# Altium project RP2040 _4 Layer_TEX(21052025).PrjPcb (part 2 of 2)

## Sheet GSM_SOM.SchDoc
size A3; SheetNumber: 6; SheetTotal: 7
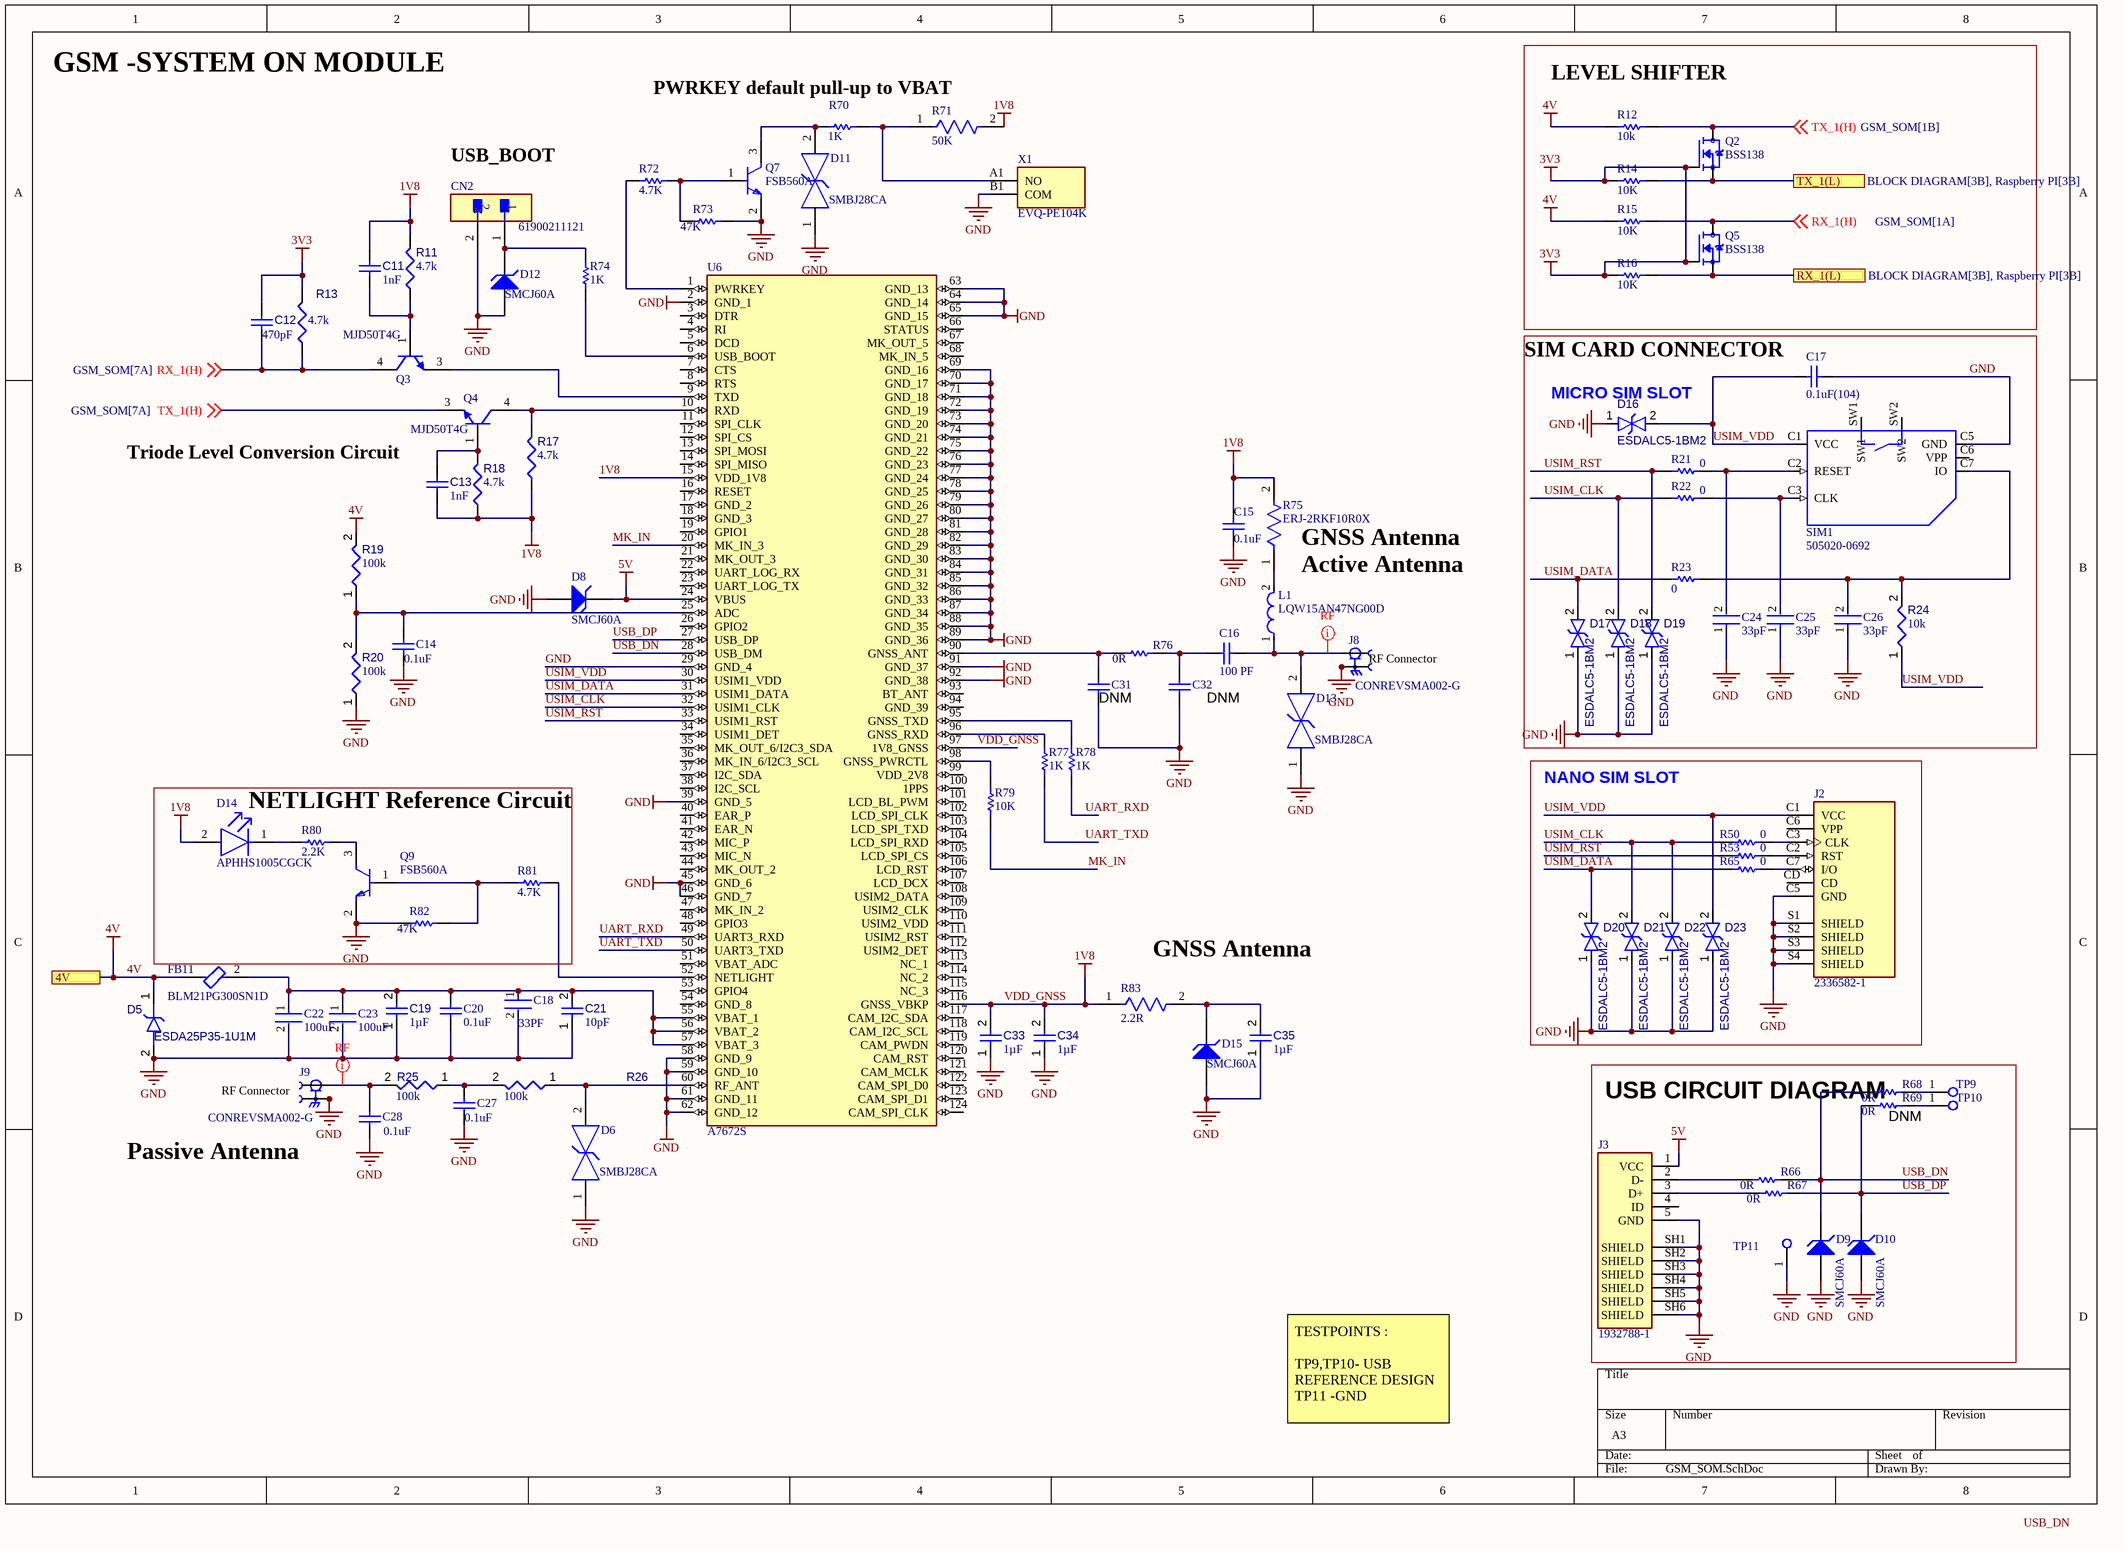
[diagram p6: GSM_SOM.SchDoc]

### Parts
C11  value 1nF  [CAPC0402(1005)33_L]  (hidden comment: Capacitor 1nF +/-20% 50V 0402)
C12  value 470pF  [CAPC0402(1005)60_L]  (hidden comment: Capacitor 470pF +/-20% 50V 0402)
C13  value 1nF  [CAPC0402(1005)33_L]  (hidden comment: Capacitor 1nF +/-20% 50V 0402)
C14  0.1uF  [CAPC1005X55X30LL05T10]
C15  0.1uF  [CAPC1005X55X30LL05T10]
C16  100 PF  [CAPC1005X55X25ML05T10]
C17  0.1uF(104)  [CAPC1005X55X30LL05T10]
C18  33PF  [FP-0402-L_1_0_1-W_0_5_0_1-IPC_A]
C19  value 1µF  [CAPC0402(1005)60_L]  (hidden comment: Capacitor 1µF +/-20% 10V 0402)
C20  0.1uF  [CAPC1005X55X30LL05T10]
C21  value 10pF  [CAPC1005X55X30LL05T10]  (hidden comment: Capacitor 10 pF +/- 0.25 pF 50 V 0402)
C22  100uF  [FP-GRM32-0_3-MFG]
C23  100uF  [FP-GRM32-0_3-MFG]
C24  33pF  [FP-0402-L_1_0_1-W_0_5_0_1-IPC_A]
C25  33pF  [FP-0402-L_1_0_1-W_0_5_0_1-IPC_A]
C26  33pF  [FP-0402-L_1_0_1-W_0_5_0_1-IPC_A]
C27  0.1uF  [CAPC1005X55X30LL05T10]
C28  0.1uF  [CAPC1005X55X30LL05T10]
C31  0.1uF  [CAPC1005X55X30LL05T10]  (value not drawn)
C32  0.1uF  [CAPC1005X55X30LL05T10]  (value not drawn)
C33  value 1µF  [CAPC0402(1005)60_L]  (hidden comment: Capacitor 1µF +/-20% 10V 0402)
C34  value 1µF  [CAPC0402(1005)60_L]  (hidden comment: Capacitor 1µF +/-20% 10V 0402)
C35  value 1µF  [CAPC0402(1005)60_L]  (hidden comment: Capacitor 1µF +/-20% 10V 0402)
CN2  61900211121  [FP-61900211121-MFG]
D5  ESDA25P35-1U1M  [STM-QFN1610]
D6  SMBJ28CA  [FP-SMBJ-CA-MFG]
D8  SMCJ60A  [LFUS-DO-214AB-2_V]
D9  SMCJ60A  [LFUS-DO-214AB-2_V]
D10  SMCJ60A  [LFUS-DO-214AB-2_V]
D11  SMBJ28CA  [FP-SMBJ-CA-MFG]
D12  SMCJ60A  [LFUS-DO-214AB-2_V]
D13  SMBJ28CA  [FP-SMBJ-CA-MFG]
D14  APHHS1005CGCK  [FP-APHHS1005CGCK-MFG]
D15  SMCJ60A  [LFUS-DO-214AB-2_V]
D16  ESDALC5-1BM2  [STM-SOD-882_V]
D17  ESDALC5-1BM2  [STM-SOD-882_V]
D18  ESDALC5-1BM2  [STM-SOD-882_V]
D19  ESDALC5-1BM2  [STM-SOD-882_V]
D20  ESDALC5-1BM2  [STM-SOD-882_V]
D21  ESDALC5-1BM2  [STM-SOD-882_V]
D22  ESDALC5-1BM2  [STM-SOD-882_V]
D23  ESDALC5-1BM2  [STM-SOD-882_V]
FB1  BLM21PG300SN1D  [FP-BLM21-0_2-t0_85-e0_5-d-MFG]
J2  2336582-1  [TE_2336582-1]
J3  1932788-1  [TE_1932788-1]
J8  CONREVSMA002-G  [LINX_CONREVSMA002-G]
J9  CONREVSMA002-G  [LINX_CONREVSMA002-G]
L1  LQW15AN47NG00D  [FP-LQW15AN_00-W0_5-0_1-MFG]
Q2  BSS138  [SOT95P240X111-3N]
Q3  MJD50T4G  [ONSC-DPAK-3-369C-01_V]
Q4  MJD50T4G  [ONSC-DPAK-3-369C-01_V]
Q5  BSS138  [SOT95P240X111-3N]
Q7  FSB560A  [FP-527AG-MFG]
Q9  FSB560A  [FP-527AG-MFG]
R11  value 4.7k  [RESC1005X40X25ML05T05]  (hidden comment: Resistor 4k7 +/-1% 0402 100 mW)
R12  10k  [RESC1005X40X25LL05T10]
R13  value 4.7k  [RESC1005X40X25ML05T05]  (hidden comment: Resistor 4k7 +/-1% 0402 100 mW)
R14  10K  [RESC1005X40X25LL05T10]
R15  10K  [RESC1005X40X25LL05T10]
R16  10K  [RESC1005X40X25LL05T10]
R17  value 4.7k  [RESC1005X40X25ML05T05]  (hidden comment: Resistor 4k7 +/-1% 0402 100 mW)
R18  value 4.7k  [RESC1005X40X25ML05T05]  (hidden comment: Resistor 4k7 +/-1% 0402 100 mW)
R19  value 100k  [RESC0402(1005)_L]  (hidden comment: Resistor 100K +/-1 % 0402 63 mW)
R20  value 100k  [RESC0402(1005)_L]  (hidden comment: Resistor 100K +/-1 % 0402 63 mW)
R21  value 0  [RESC1005X40X25ML05T10]  (hidden comment: Resistor 0R 0402 63 mW)
R22  value 0  [RESC1005X40X25ML05T10]  (hidden comment: Resistor 0R 0402 63 mW)
R23  value 0  [RESC1005X40X25ML05T10]  (hidden comment: Resistor 0R 0402 63 mW)
R24  value 10k  [RESC1005X40X25ML05T05]  (hidden comment: Resistor 10k +/-1% 0402 100 mW)
R25  value 100k  [RESC0402(1005)_L]  (hidden comment: Resistor 100K +/-1 % 0402 63 mW)
R26  value 100k  [RESC0402(1005)_L]  (hidden comment: Resistor 100K +/-1 % 0402 63 mW)
R50  value 0  [RESC1005X40X25ML05T10]  (hidden comment: Resistor 0R 0402 63 mW)
R53  value 0  [RESC1005X40X25ML05T10]  (hidden comment: Resistor 0R 0402 63 mW)
R65  value 0  [RESC1005X40X25ML05T10]  (hidden comment: Resistor 0R 0402 63 mW)
R66  0R  [RESC1005X40X25NL05T10]
R67  0R  [RESC1005X40X25NL05T10]
R68  0R  [RESC1005X40X25NL05T10]
R69  0R  [RESC1005X40X25NL05T10]
R70  1K  [RESC1005X40X25NL05T05]
R71  50K  [FP-CRCW0402-e3-IPC_A]
R72  4.7K  [RESC1005X40X25LL05T05]
R73  47K  [RESC1005X40X25ML05T10]
R74  1K  [RESC1005X40X25NL05T05]
R75  ERJ-2RKF10R0X  [FP-ERJ2RK-MFG]
R76  0R  [RESC1005X40X25NL05T10]
R77  1K  [RESC1005X40X25NL05T05]
R78  1K  [RESC1005X40X25NL05T05]
R79  10K  [RESC1005X40X25LL05T05]
R80  2.2K  [RESC1005X40X25NL05T10]
R81  4.7K  [RESC1005X40X25LL05T05]
R82  47K  [RESC1005X40X25ML05T10]
R83  2.2R  [FP-CRCW0402-e3-IPC_C]
SIM1  505020-0692  [505020-0692]
TP9  Test Point  [TEST_POINT_SMD_30D]  (value not drawn)
TP10  Test Point  [TEST_POINT_SMD_30D]  (value not drawn)
TP11  Test Point  [TEST_POINT_SMD_30D]  (value not drawn)
U6  A7672S  [A7672S]
X1  EVQ-PE104K  [EVQPE104K]

### Blocks framed on the sheet
LEVEL SHIFTER: Q2 Q5 R12 R14-R16
SIM CARD CONNECTOR: C17 C24-C26 D16-D19 R21-R24 SIM1
NANO SIM SLOT: D20-D23 J2 R50 R53 R65
NETLIGHT Reference Circuit: D14 Q9 R80-R82
USB CIRCUIT DIAGRAM: D9 D10 J3 R66-R69 TP9-TP11

### Ports
4V (see BLOCK DIAGRAM[3B], Power circuit[4D]), RX_1(L) (see BLOCK DIAGRAM[3B], Raspberry PI[3B]), TX_1(L) (see BLOCK DIAGRAM[3B], Raspberry PI[3B])

### Nets
1V8: C11.1 C13.2 C15.2 C33.2 C34.2 D14.2(A) R11.2 R17.1 R18.1 R71.2 R75.2 R83.1 U6.15(VDD_1V8) U6.97(1V8_GNSS) U6.116(GNSS_VBKP)  [also labelled VDD_GNSS]
3V3: C12.2 Q2.1(G) Q5.1(G) R13.2 R14.1 R16.1
4V: D5.1(A) FB1.1 R12.1 R15.1 R19.2 ; port 4V
5V: D8.2(K) J3.1(VCC) U6.24(VBUS)
GND: C14.2 C15.1 C17.2 C18.2 C19.1 C20.2 C21.1 C22.2 C23.2 C24.1 C25.1 C26.1 C27.2 C28.2 C31.1 C32.1 C33.1 C34.1 C35.1 CN2.2 D5.2(A) D6.1 D8.1(A) D9.1(A) D10.1(A) D11.1 D12.1(A) D13.1 D15.1(A) D16.1(A) D17.1(A) D18.1(A) D19.1(A) D20.1(A) D21.1(A) D22.1(A) D23.1(A) J2.C5(GND) J2.S1(SHIELD) J2.S2(SHIELD) J2.S3(SHIELD) J2.S4(SHIELD) J3.5(GND) J3.SH1(SHIELD) J3.SH2(SHIELD) J3.SH3(SHIELD) J3.SH4(SHIELD) J3.SH5(SHIELD) J3.SH6(SHIELD) J8.S1 J8.S2 J8.S3 J8.S4 J9.S1 J9.S2 J9.S3 J9.S4 Q7.2(E) Q9.2(E) R20.1 R73.2 R82.1 SIM1.C5(GND) TP11.1 U6.2(GND_1) U6.29(GND_4) U6.39(GND_5) U6.45(GND_6) U6.46(GND_7) U6.58(GND_9) U6.59(GND_10) U6.61(GND_11) U6.62(GND_12) U6.63(GND_13) U6.64(GND_14) U6.65(GND_15) U6.69(GND_16) U6.70(GND_17) U6.71(GND_18) U6.72(GND_19) U6.73(GND_20) U6.74(GND_21) U6.75(GND_22) U6.76(GND_23) U6.77(GND_24) U6.78(GND_25) U6.79(GND_26) U6.80(GND_27) U6.81(GND_28) U6.82(GND_29) U6.83(GND_30) U6.84(GND_31) U6.85(GND_32) U6.86(GND_33) U6.87(GND_34) U6.88(GND_35) U6.89(GND_36) U6.91(GND_37) U6.92(GND_38) X1.B1(COM)
MK_IN: R79.1 U6.20(MK_IN_3)  [project net MK_IN_6]
RX_1(H): C12.1 Q3.4(C) Q5.3(D) R13.1 R15.2 ; off-sheet RX_1(H)
RX_1(L): Q5.2(S) R16.2 ; port RX_1(L)
TX_1(H): Q2.3(D) Q4.3(E) R12.2 ; off-sheet TX_1(H)
TX_1(L): Q2.2(S) R14.2 ; port TX_1(L)
UART_RXD: R78.1 U6.49(UART3_RXD)  [project net UART_RXD_6]
UART_TXD: R77.1 U6.50(UART3_TXD)  [project net UART_TXD_6]
USB_DN: D9.2(K) R66.2 R68.1 U6.28(USB_DM)  [project net USB_DN_6]
USB_DP: D10.2(K) R67.2 R69.1 U6.27(USB_DP)  [project net USB_DP_6]
USIM_CLK: D18.2(A) D21.2(A) D22.2(A) R22.1 R50.1 U6.32(USIM1_CLK)  [project net USIM_CLK_6]
USIM_DATA: D17.2(A) D20.2(A) R23.1 R65.1 U6.31(USIM1_DATA)  [project net USIM_DATA_6]
USIM_RST: D19.2(A) R21.1 R53.1 U6.33(USIM1_RST)  [project net USIM_RST_6]
USIM_VDD: C17.1 D16.2(A) D23.2(A) J2.C1(VCC) R24.1 SIM1.C1(VCC) U6.30(USIM1_VDD)  [project net USIM_VDD_6]
NetC11_2: C11.2 Q3.1(B) R11.1
NetC13_1: C13.1 Q4.1(B) R18.2
NetC14_1: C14.1 R19.1 R20.2 U6.25(ADC)
NetC16_1: C16.1 C32.2 R76.2
NetC16_2: C16.2 D13.2 J8.1 L1.1
NetC18_1: C18.1 C19.2 C20.1 C21.2 C22.1 C23.1 FB1.2 U6.55(VBAT_1) U6.56(VBAT_2) U6.57(VBAT_3)
NetC24_2: C24.2 R21.2 SIM1.C2(RESET)
NetC25_2: C25.2 R22.2 SIM1.C3(CLK)
NetC26_2: C26.2 R23.2 R24.2 SIM1.C7(IO)
NetC27_1: C27.1 R25.1 R26.2
NetC28_1: C28.1 J9.1 R25.2
NetC31_2: C31.2 R76.1 U6.90(GNSS_ANT)
NetC35_2: C35.2 D15.2(K) R83.2
NetCN2_1: CN2.1 D12.2(K) R74.2
NetD6_2: D6.2 R26.1 U6.60(RF_ANT)
NetD11_2: D11.2 Q7.3(C) R70.1
NetD14_1: D14.1(C) R80.1
NetJ2_C2: J2.C2(RST) R53.2
NetJ2_C3: J2.C3(CLK) R50.2
NetJ2_C7: J2.C7(I/O) R65.2
NetJ3_2: J3.2(D-) R66.1
NetJ3_3: J3.3(D+) R67.1
NetL1_2: L1.2 R75.1
NetQ3_3: Q3.3(E) U6.9(TXD)
NetQ4_4: Q4.4(C) R17.2 U6.10(RXD)
NetQ7_1: Q7.1(B) R72.2 R73.1
NetQ9_1: Q9.1(B) R81.2 R82.2
NetQ9_3: Q9.3(C) R80.2
NetR68_2: R68.2 TP9.1
NetR69_2: R69.2 TP10.1
NetR70_2: R70.2 R71.1 X1.A1(NO)
NetR72_1: R72.1 U6.1(PWRKEY)
NetR74_1: R74.1 U6.6(USB_BOOT)
NetR77_2: R77.2 U6.96(GNSS_RXD)
NetR78_2: R78.2 U6.95(GNSS_TXD)
NetR79_2: R79.2 U6.98(GNSS_PWRCTL)
NetR81_1: R81.1 U6.52(NETLIGHT)

Not connected (* = marked no-connect by the designer): J2 C6(VPP) CD; J3 4(ID); SIM1 C6(VPP) SW1 SW2; U6 3(DTR) 4(RI) 5(DCD) 7(CTS) 8(RTS) 11(SPI_CLK) 12(SPI_CS) 13(SPI_MOSI) 14(SPI_MISO) 16(RESET) 17(GND_2) 18(GND_3) 19(GPIO1) 21(MK_OUT_3) 22(UART_LOG_RX) 23(UART_LOG_TX) 26(GPIO2) 34(USIM1_DET) 35(MK_OUT_6/I2C3_SDA) 36(MK_IN_6/I2C3_SCL) 37(I2C_SDA) 38(I2C_SCL) 40(EAR_P) 41(EAR_N) 42(MIC_P) 43(MIC_N) 44(MK_OUT_2) 47(MK_IN_2) 48(GPIO3) 51(VBAT_ADC) 53(GPIO4) 54(GND_8) 66(STATUS) 67(MK_OUT_5) 68(MK_IN_5) 93(BT_ANT) 94(GND_39) 99(VDD_2V8) 100(1PPS) 101(LCD_BL_PWM) 102(LCD_SPI_CLK) 103(LCD_SPI_TXD) 104(LCD_SPI_RXD) 105(LCD_SPI_CS) 106(LCD_RST) 107(LCD_DCX) 108(USIM2_DATA) 109(USIM2_CLK) 110(USIM2_VDD) 111(USIM2_RST) 112(USIM2_DET) 113(NC_1) 114(NC_2) 115(NC_3) 117(CAM_I2C_SDA) 118(CAM_I2C_SCL) 119(CAM_PWDN) 120(CAM_RST) 121(CAM_MCLK) 122(CAM_SPI_D0) 123(CAM_SPI_D1) 124(CAM_SPI_CLK)

### Layout directives
mark named RF: NetC16_2, NetC28_1

### Notes on the sheet
- GSM -SYSTEM ON MODULE
- PWRKEY default pull-up to VBAT
- USB_BOOT
- (near D16) MICRO SIM SLOT
- (near C13) Triode Level Conversion Circuit
- Active Antenna
- (near R75) GNSS Antenna
- (near C31) DNM
- DNM
- (near J8) RF Connector
- (near R83) GNSS Antenna
- (near J9) RF Connector
- (near R69) DNM
- Passive Antenna
- TESTPOINTS :
  TP9,TP10- USB REFERENCE DESIGN
  TP11 -GND
- Labels drawn without touching a wire or pin: USB_DN

### Library data of the parts
C11 C13 = CMP-001-00066-3: Chip Capacitor, 1nF +/-20%, 50V, 0402, Thickness 0.33 mm; Tolerance: 10%; Case/Package: 0402; Pins: 2; Min Operating Temperature: -55°C; Max Operating Temperature: 85°C; Voltage Rating: 50V; Mounting Technology: SMT
C12 = CMP-001-00068-4: Chip Capacitor, 470pF +/-20%, 50V, 0402, Thickness 0.6 mm; Tolerance: 20%; Mounting Technology: SMT; Max Operating Temperature: 85°C; Min Operating Temperature: -55°C; Pins: 2; Voltage Rating: 50V; Case/Package: 0402
C14 C15 C17 C20 C27 C28 C31 C32 = CMP-0001-00074-2: Manufacturer: Kemet; Part Number: C0402C104K4RACTU
C16 = CMP-2008-03915-1: Manufacturer: Murata; Part Number: GRM1555C1H101JA01D
C18 C24-C26 = CMP-2008-02637-2: General Purpose Ceramic Capacitor, 0402, 33pF, 5%, C0G, 30ppm/°C, 50V; Insulation Resistance: 100GR; REACH SVHC: No SVHC; Radiation Hardening: No; Voltage Rating (DC): 50V; Tolerance: 5%; Voltage Rating: 50V; Mount: Surface Mount; Packaging: Tape and Reel; Construction: Flat; Voltage: 50V; Case/Package: 0402; Temperature Coefficient: 30ppm/°C; Lead Free: Lead Free; Case Code (Metric): 1005; Number of Pins: 2; Min Operating Temperature: -55°C; Capacitance: 33pF; Width: 0.5mm; Dielectric: C0G; Height: 0.5mm; Thickness: 0.022inch; Contact Plating: Tin; Length: 1mm; Package Quantity: 1; Depth: 0.5mm; Termination: SMD/SMT; Max Operating Temperature: 125°C; RoHS Compliant: Yes; Case Code (Imperial): 0402; Series: -
C19 C33-C35 = CMP-001-00063-3: Chip Capacitor, 1µF +/-20%, 10V, 0402, Thickness 0.6 mm; Tolerance: 10%; Mounting Technology: SMT; Max Operating Temperature: 85°C; Voltage Rating: 10V; Pins: 2; Case/Package: 0402; Min Operating Temperature: -55°C
C21 = CMP-001-00011-6: Chip Capacitor, 10 pF, +/- 0.25 pF, 50 V, 0402 (1005 Metric); Voltage Rating: 50V; Tolerance: 0.25%; Capacitor Type: Ceramic; Mounting Technology: SM; Pins: 2; Case/Package: 0402; Min Operating Temperature: -55°C; RoHS Compliant: True; Max Operating Temperature: 125°C
C22 C23 = CMP-2000-05259-2: CAP CER 100UF 6.3V X5R 1210; 3DS Part Number: 220-00002; Manufacturer Part Number: GRM32ER60J107ME20L; Manufacturer: Murata; Temperature Coefficient: 15%; Material: Ceramic; Tolerance: 20%; Octopart: https://octopart.com/grm32er60j107me20l-murata-197007; ComponentLink2URL: https://search.murata.co.jp/Ceramy/image/img/A01X/G101/ENG/GRM32ER60J107ME20-01.pdf; Temperature Range High: +85°C; RoHS: TRUE; Device Class L3: Ceramic Capacitors; Device Class L2: Capacitors; Voltage: 6.3V; Package: GRM32-0.3; Voltage Rating: 6.3V; Category: Cap; Device Class L1: Passive Components; Temperature Characteristic: X5R; Automotive: No; Digikey Description: CAP CER 100UF 6.3V X5R 1210; Temperature: -55°C to +85°C; Height: 2.7mm; Ipc Land Pattern Name: CAPC320250X250; Capacitance: 100uF; Temperature Range Low: -55°C; Lead Free: Yes; Value: 100uF; ComponentLink2Description: Datasheet
CN2 = CMP-1502-00584-2: CONN HEADER VERT 2POS 2.54MM; Number of Contacts: 2; Gender: Male; Current Rating: 3A; Voltage Rating: 250V; Insulation Resistance: 1GR; Contact Material: Copper Alloy; Package Quantity: 1000; Color: Beige; Mount: Through Hole; Termination: Through Hole; Fastening Type: Friction; Contact Mating Length: 0.295inch; Pitch: 2.54mm; Max Operating Temperature: 105°C; Height: 14.2mm; RoHS Compliant: Yes; Packaging: Bulk; Contact Type: Male Pin; Width: 5.12mm; Housing Material: Nylon; Min Operating Temperature: -40°C; Insulation Material: Nylon; Contact Finish - Mating: TIN; Insulation Color: Beige; Contact Plating: Tin; Flammability Rating: UL94 V-0; Length: 5.8mm; Contact Gender: Male; Connector Type: Header; Contact Shape: Square; Series: WR-WTB; Number of Positions: 2; Number of Rows: 1
D5 = CMP-004-00023-3: TVS DIODE 22V 41V 1610; Peak Inverse Voltage: 23.3V; Max Surge Current: 35A; Mounting Technology: SMT; Case/Package: QFN1610 (0603); RoHS Compliant: Yes; Pins: 2
D6 D11 D13 = CMP-08607-000057-1: TVS DIODE 28V 45.4V DO214AA; Manufacturer: Littelfuse Inc; Direction: Bidirectional; Peak Pulse Power: 600W; Max Junction Temp: +150°C; Peak Pulse Current: 13.3A; Breakdown Voltage: 31.1V; Number Of Channels: 1; Digikey Description: TVS DIODE 28V 45.4V DO214AA; Temperature Range Low: -65°C; Device Class L1: Circuit Protection; Automotive: No; Device Class L3: unset; Octopart: https://octopart.com/smbj28ca-littelfuse-350757; Temperature Range High: +150°C; Reverse Standoff Voltage: 28V; Mouser Description: In a Pack of 10, Littelfuse SMBJ28CA, Bi-Directional TVS Diode, 600W, 2-Pin DO-214AA; Category: Diode; Device Class L2: TVS Diodes; ComponentLink2URL: https://www.littelfuse.com/~/media/electronics/datasheets/tvs_diodes/littelfuse_tvs_diode_smbj_datasheet.pdf.pdf; Clamping Voltage: 45.4V; Manufacturer Part Number: SMBJ28CA; RoHS: TRUE; Height: 2.61mm; Package: SMBJ-CA; ComponentLink2Description: Datasheet; Lead Free: Yes; Temperature: -65°C to +150°C
D8-D10 D12 D15 = CMP-2000-07111-1: Transient Voltage Suppression Diode, 60 V, -65 to 150 degC, 2-Pin DO-214AB (SMCJ), RoHS, Tape and Reel; Manufacturer: Littelfuse; Type: Zener; Featured Product: LittelfuseandDigi-KeyofferkitsforpopularTVSSMDdiodes; Power - Peak Pulse: 1500W(1.5kW); Current - Peak Pulse (10/1000µs): 145.7A; Power Line Protection: No; Voltage - Clamping (Max) @ Ipp: 10.3V; Unidirectional Channels: 1; Voltage - Reverse Standoff (Typ): 6V; Catalog Drawings: SMCJDO-214ABSeries; Voltage - Breakdown (Min): 6.67V; Bidirectional Channels: -; Series: SMCJ; Mounting Technology: SurfaceMount; Supplier Device Package: DO-214AB(SMCJ); Packaging: Tape&Reel(TR); Family: TVS-Diodes; Applications: GeneralPurpose; Package Description: 2-Pin Surface Mount Device, Body 6.855 x 5.905 mm; Datasheet Version: 11/2015; Operating Temperature: -55°C~150°C(TJ); Package Reference: DO-214AB; Capacitance @ Frequency: -; Datasheet URL: http://www.littelfuse.com/products/tvs-diodes/surface-mount/~/media/electronics/datasheets/tvs_diodes/littelfuse_tvs_diode_smcj_datasheet.pdf.pdf; Category: CircuitProtection; Package / Case: DO-214AB,SMC; Mounting Type: SurfaceMount; Manufacturer URL: http://www.littelfuse.com/; Standard Package: 3,000
D14 = CMP-44529-000044-1: LED GREEN CLEAR CHIP SMD; Viewing Angle: 120°; Dominant Wavelength: 570nm; Test Current: 20mA; Luminous Intensity: 50mcd; Forward Voltage: 2.1V; Number of LEDs: 1; Lens Color: Clear; Packaging: Tape and Reel; Max Operating Temperature: 85°C; Illumination Color: Green; Length: 1mm; Mount: Surface Mount; Lens Style: Clear; Color: Green; Number of Pins: 2; Wavelength: 570nm; Case/Package: 0402; Width: 0.5mm; Package Quantity: 2000; Case Code (Metric): 1005; Height: 0.6mm; Lead Free: Lead Free; Case Code (Imperial): 0402; Forward Current: 20mA; Min Operating Temperature: -40°C
D16-D23 = CMP-004-00030-3: Single Line Low Capacitance Transil™, 5 V, -55 to 150 degC, 2-Pin SOD-882, RoHS, Tape and Reel; Mounting Technology: SMT; Pins: 2
FB1 = CMP-0686-00620-3: Chip Ferrite Bead, 0805, 30Ω @ 100MHz, 0.014Ω, , 4A; Tolerance: 25%; Number of Circuits: 1; Impedance: 30R; Max DC Current: 3A; Shielding: Unshielded; Material: Steel; Resistance: 15mR; DC Resistance-Max: 14mR; Series: BLM21P; Military Standard: Not; Max Current Rating: 4A; Termination: SMD/SMT; Length: 2mm; Width: 1.25mm; Test Frequency: 100MHz; Packaging: Tape and Reel; Case/Package: 0805; Current Rating: 4A; Depth: 1.25mm; Package Quantity: 1; REACH SVHC: No SVHC; Core Material: Ferrite; Max Operating Temperature: 125°C; DC Current: 3A; Height: 0.85mm; Frequency: 100MHz; Number of Lines: 1; Case Code (Metric): 2012; Min Operating Temperature: -55°C; Radiation Hardening: No; Case Code (Imperial): 0805; Number of Pins: 2; RoHS Compliant: Yes; DC Resistance (DCR): 14mR; Lead Free: Lead Free
J2 = 2336582-1: PUSH-PUSH NANO SIM CONNECTOR; Package: None; Price: None; Value: *; MP: 2336582-1; Availability: Unavailable
J8 J9 = CONREVSMA002-G: RP-SMA Female Right-Angle Through-Hole Mount Connector, Gold; MF: Linx Technologies; SnapEDA_Link: https://www.snapeda.com/parts/CONREVSMA002-G/Linx+Technologies+Inc./view-part/?ref=snap; Package: None; Value: *; MP: CONREVSMA002-G; Check_prices: https://www.snapeda.com/parts/CONREVSMA002-G/Linx+Technologies+Inc./view-part/?ref=eda
L1 = CMP-06042-006618-1: Wire Wound RF Inductor 47nH ±2% 210mA 1.08Ω 0402 (1005); Core Material: Air; Q Factor: 25; Current: 600mA; Test Frequency: 100MHz; DC Resistance (DCR): 1.08R; Shielding: Unshielded; Self Resonant Frequency: 2.9GHz; Packaging: Tape and Reel; Current Rating: 210mA; Mount: Surface Mount; REACH SVHC: No SVHC; Min Operating Temperature: -55°C; Package Quantity: 10000; Inductance Tolerance: 2%; Inductance: 47nH; Lead Free: Lead Free; Height: 0.5mm; Depth: 0.6mm; Weight: 2.8E-05oz; Max Operating Temperature: 125°C; Radiation Hardening: No; DC Current: 210mA; Number of Pins: 2; Width: 0.02inch; Military Standard: Not; Termination: SMD/SMT; Tolerance: 2%; Max DC Current: 210mA; Case Code (Imperial): 0402; Case/Package: 0402; Length: 1mm; Case Code (Metric): 1005
Q2 Q5 = BSS138: N-Channel 50V 220mA (Ta) 360mW (Ta) Surface Mount SOT-23-3; MF: ON Semiconductor; MP: BSS138; Price: None; SnapEDA_Link: https://www.snapeda.com/parts/BSS138/ON%20Semiconductor/view-part/4794929/?ref=snap; Availability: Good; Purchase-URL: https://pricing.snapeda.com/search/part/BSS138/?ref=eda; Value: *; Check_prices: https://www.snapeda.com/parts/BSS138/ON%20Semiconductor/view-part/4794929/?ref=eda; Package: SOT-23 ON Semiconductor
Q3 Q4 = CMP-1048-00190-1: High Voltage Power Transistor, 3-Pin DPAK, Pb-Free, Tape and Reel; Manufacturer: On Semiconductor; Polarity: NPN; fT Min (MHz): 10; IC Continuous (A): 1; ComponentLink1Description: Manufacturer URL; PartNumber: MJD50T4G; ComponentLink3URL: http://www.onsemi.cn/pub_link/Collateral/369C.PDF; Mounting Technology: Surface Mount; DatasheetVersion: Rev. 14; PackageDescription: 3-Pin Flange Mount, Body 6.54 x 6.095 mm, Pitch 2.29 mm; ComponentLink1URL: http://www.onsemi.com/; RoHS: TRUE; ComponentLink2Description: Datasheet; PackageVersion: Rev. E, 02/2014; ComponentLink3Description: Package Specification; PackageReference: DPAK-3-369C-01; ComponentLink2URL: http://www.onsemi.cn/pub_link/Collateral/MJD47-D.PDF; Packing: Tape and Reel
Q7 Q9 = CMP-00278-84328379-1: FSB560A Bipolar Transistors - BJT NPN Transistor Low Saturation; Manufacturer Lifecycle Status: ACTIVE; Transition Frequency: 75MHz; Power Dissipation: 500mW; Current Rating: 2A; Collector Emitter Breakdown Voltage: 60V; hFE Min: 250; Number of Elements: 1; Max Breakdown Voltage: 25V; Emitter Base Voltage (VEBO): 5V; Collector Base Voltage (VCBO): 80V; Element Configuration: Single; Collector Emitter Saturation Voltage: 300mV; Lead Free: Lead Free; Voltage Rating (DC): 60V; Lifecycle Status: Production; Mount: Surface Mount; Polarity: NPN; Max Frequency: 75MHz; Frequency: 75MHz; Width: 1.4mm; RoHS: Compliant; Min Operating Temperature: -55°C; Case/Package: TO-236-3; Height: 940µm; Max Collector Current: 2A; Collector Emitter Voltage (VCEO): 60V; Gain Bandwidth Product: 75MHz; Weight: 30mg; NexarPartId: 84328379; Length: 2.92mm; Max Power Dissipation: 500mW; Schedule B: 8541210080; Radiation Hardening: No; Max Operating Temperature: 150°C; Number of Pins: 3
R11 R13 R17 R18 = CMP-009-00030-5: Chip Resistor, 4.7 KOhm, +/- 1%, 0.1 W, -55 to 155 degC, 0402 (1005 Metric); Power: 100mW; Voltage Rating: 50V; Mounting Technology: SM; RoHS Compliant: True; Tolerance: 1%; Min Operating Temperature: -55°C; Max Operating Temperature: 155°C; Case/Package: 0402; Pins: 2
R12 R14-R16 = CMP-2002-07353-1: Part Number: RC0402FR-0710KL; Manufacturer: Yageo / Phycomp
R19 R20 R25 R26 = CMP-009-00168-3: Chip Resistor, 100 kOhms, +/-1 %, 63 mW, -55 to 155 degC, 0402; Tolerance: 1%; Power: 63mW; Max Operating Temperature: 155°C; Min Operating Temperature: -55°C; Pins: 2; Case/Package: 0402
R21-R23 R50 R53 R65 = CMP-009-00004-5: Chip Resistor, 0 Ohm, 0.063 W, -55 to 155 degC, 0402 (1005 Metric); Power: 63mW; Voltage Rating: 50V; Max Operating Temperature: 155°C; Pins: 2; RoHS Compliant: True; Min Operating Temperature: -55°C; Mounting Technology: SM; Case/Package: 0402
R24 = CMP-009-00015-5: Chip Resistor, 10 KOhm, +/- 1%, 0.1 W, -55 to 155 degC, 0402 (1005 Metric); Voltage Rating: 50V; Power: 100mW; Case/Package: 0402; RoHS Compliant: True; Min Operating Temperature: -55°C; Mounting Technology: SM; Tolerance: 1%; Max Operating Temperature: 155°C; Pins: 2
R66-R69 R76 = CMP-1011-00001-2: Manufacturer: Yageo / Phycomp; Part Number: RC0402JR-070RL
R70 R74 R77 R78 = CMP-1011-00510-4: Chip Resistor, 1 KOhm, +/- 1%, 100 mW, -55 to 155 degC, 0402 (1005 Metric), RoHS, Tape and Reel; PartNumber: ERJ-2RKF1001X; Manufacturer: Basic Passives; Voltage Rating: 50 V; Case\/Package: 0402; Resistance: 1 KOhm; Power Rating: 100 mW; DatasheetVersion: 04/2015; Radiation Hardening: No; Pins: 2; Height: 0.35 mm; RoHSCompliant: true; Case Code (Imperial): 0402; ComponentLink2Description: Datasheet; ComponentLink1Description: Manufacturer URL; PackageReference: 0402; Mount: Surface Mount; Package Quantity: 10000; Tolerance: 1%; ComponentLink1URL: http://www.panasonic.com/; PackageDescription: 2-Pin Surface Mount Device, Body 1 x 0.5 mm; Mounting Technology: Surface Mount; Case Code (Metric): 1005; ComponentLink2URL: http://industrial.panasonic.com/cdbs/www-data/pdf/RDA0000/AOA0000C86.pdf; REACH SVHC: Yes; Packaging: Tape and Reel; Max Operating Temperature: 155 degC; Min Operating Temperature: -55 degC; Width: 0.5 mm; Length: 1 mm
R71 = CMP-02407-005152-1: RES Thick Film, 50kΩ, 1%, 0.063W, 100ppm/°C, 0402; Power Rating: 63mW; Voltage Rating: 50V; Resistance: 50kR; Package Quantity: 10000; Case/Package: 0402; Max Operating Temperature: 155°C; Case Code (Metric): 1005; Termination: SMD/SMT; Lead Free: Lead Free; Height: 0.35mm; Width: 0.5mm; Packaging: Tape and Reel; Min Operating Temperature: -55°C; Length: 1mm; Tolerance: 1%; Case Code (Imperial): 0402; Weight: 2.3E-05oz
R72 R81 = CMP-2002-01154-4: Chip Resistor, 4.7 KOhm, +/- 1%, 0.1 W, -55 to 155 degC, 0402 (1005 Metric), RoHS, Tape and Reel; PartNumber: ERJ-2RKF4701X; Voltage Rating: 50 V; Case\/Package: 0402; Power Rating: 100 mW; Height: 0.35 mm; Mounting Technology: Surface Mount; REACH SVHC: Yes; Resistance: 4.7 KOhm; Max Operating Temperature: 155 degC; ComponentLink1Description: Manufacturer URL; ComponentLink2Description: Datasheet; Pins: 2; PackageReference: 0402; Tolerance: 1%; Case Code (Imperial): 0402; Length: 1 mm; PackageDescription: 2-Pin Surface Mount Device, Body 1 x 0.5 mm; RoHSCompliant: true; Package Quantity: 1; Radiation Hardening: No; DatasheetVersion: 04/2015; Width: 0.5 mm; Case Code (Metric): 1005; Mount: Surface Mount; ComponentLink1URL: http://www.panasonic.com/; Min Operating Temperature: -55 degC; Packaging: Cut Tape; ComponentLink2URL: http://industrial.panasonic.com/cdbs/www-data/pdf/RDA0000/AOA0000C86.pdf
R73 R82 = CMP-2002-07701-1: Part Number: RC0402FR-0747KL; Manufacturer: Yageo / Phycomp
R75 = CMP-2002-00622-4: RES SMD 10 OHM 1% 1/10W 0402; Manufacturer: Panasonic; Power Rating: 0.1W; Value: 10Ω; Automotive Grade: Grade 0; Temperature Coefficient: 100ppm/°C; Voltage Rating: 50V; Octopart: https://octopart.com/erj-2rkf10r0x-panasonic-55404982; Digikey Description: RES SMD 10 OHM 1% 1/10W 0402; Mouser Description: Thick Film Resistors - SMD 0402 10.0ohms 1% Tol AEC-Q200; Series: ERJ; Temperature Range High: +155°C; ComponentLink2Description: Datasheet; Tolerance: 1%; Manufacturer Part Number: ERJ-2RKF10R0X; Temperature Range Low: -55°C; RoHS: TRUE; Footprint Url: https://industrial.panasonic.com/cdbs/www-data/pdf/RDA0000/DMA0000COL17.pdf; Lead Free: Yes; Device Class L2: Resistors; ComponentLink2URL: https://industrial.panasonic.com/cdbs/www-data/pdf/RDA0000/AOA0000C304.pdf; Height: 0.4mm; Device Class L3: Chip SMD Resistors; Device Class L1: Passive Components; Automotive: Yes; Resistance: 10Ω; Category: Res; Temperature: -55°C to +155°C; Composition: Thick Film; Package: ERJ2RK
R79 = CMP-2000-07588-1: Chip Resistor, 10 KOhm, +/- 1%, 0.1 W, -55 to 155 degC, 0402 (1005 Metric), RoHS, Tape and Reel; Manufacturer: Panasonic; Power Rating: 100mW; Voltage Rating: 50V; Resistance: 10KOhm; Case\/Package: 0402; Temperature Coefficient: 100ppm\/degreesC; RoHSCompliant: True; Lead Free: LeadFree; Package Quantity: 1; Contact Plating: Tin; Length: 1mm; Radiation Hardening: No; REACH SVHC: NoSVHC; Max Operating Temperature: 155degC; Depth: 0.5mm; Case Code (Imperial): 0402; Military Standard: Not; Package Description: 2-Pin Surface Mount Device, Body 1 x 0.5 mm; Termination: SMD/SMT; Case Code (Metric): 1005; Height: 0.35mm; Packaging: TapeandReel; Voltage Rating (DC): 50V; Package Reference: 402; Number of Pins: 2; Tolerance: 1%; Mounting Technology: SurfaceMount; Width: 0.02inch; Mount: SurfaceMount; Datasheet URL: https://industrial.panasonic.com/cdbs/www-data/pdf/RDA0000/AOA0000C304.pdf; Composition: ThickFilm; Datasheet Version: 02/2017; Manufacturer URL: http://www.panasonic.com/; Max Power Dissipation: 100mW; Number of Terminations: 2; Min Operating Temperature: -55degC
R80 = CMP-2002-07567-1: Manufacturer: Yageo / Phycomp; Part Number: RC0402FR-072K2L
R83 = CMP-1011-00207-2: RES Thick Film, 2.2Ω, 1%, 0.063W, 100ppm/°C, 0402; Voltage Rating: 50V; Max Power Dissipation: 63mW; Weight: 2.3E-05oz; Max Operating Temperature: 155°C; Number of Terminations: 2; Depth: 0.5mm; Voltage Rating (DC): 50V; Case/Package: 0402; Height: 0.35mm; Resistance: 2.2R; Lead Free: Lead Free; Width: 0.5mm; Package Quantity: 10; Termination: SMD/SMT; Number of Pins: 2; Case Code (Metric): 1005; Composition: Thick Film; Packaging: Tape and Reel; Temperature Coefficient: 100ppm/°C; Case Code (Imperial): 0402; Radiation Hardening: No; Features: Automotive AEC-Q200; Military Standard: Not; Contact Plating: Tin; Tolerance: 1%; Power Rating: 63mW; Length: 1mm; Min Operating Temperature: -55°C
SIM1 = 505020-0692: 6 Position Card Connector Micro SIM Surface Mount, Right Angle Gold; MF: Molex; MP: 5050200692; Price: None; SnapEDA_Link: https://www.snapeda.com/parts/5050200692/Molex/view-part/470352/?ref=snap; Check_prices: https://www.snapeda.com/parts/5050200692/Molex/view-part/470352/?ref=eda; Purchase-URL: https://pricing.snapeda.com/search/part/5050200692/?ref=eda; Availability: Warning; Package: None; Value: *
TP9-TP11 = TP: TEST POINT PC MINI .040"D RED; MFG: Keystone; MFG_PN: 5000; ASSEMBLY_TYPE: TH; MACRO: Power Management (VYS, 5V, 3.3V and Reset); PACKAGE: Assembly; TEMPERATURE: -55°C ~ 155°C
U6 = A7672S: LTE Cat 1 Module On Module 10Mbps 700MHz/800MHz/900MHz/1700MHz/1800MHz/1900MHz/2100MHz 33dBm 3.4V to 4.2V -109dBm; MF: SIMCom; SnapEDA_Link: https://www.snapeda.com/parts/A7672S/SIMCom/view-part/?ref=snap; Package: Package; Value: *; MP: A7672S; Check_prices: https://www.snapeda.com/parts/A7672S/SIMCom/view-part/?ref=eda
X1 = EVQ-PE104K: Switch Tactile N.O. SPST Rectangular Button J-Bend 0.05A 12VDC 1N SMD T/R; Manufacturer_Name: Panasonic; Geometry.Height: 4.6mm; Mouser Part Number: 667-EVQ-PE104K; Mouser Price/Stock: https://www.mouser.co.uk/ProductDetail/Panasonic/EVQ-PE104K?qs=wX5mvoJE4NGLiYsCBZAptQ%3D%3D; Manufacturer_Part_Number: EVQ-PE104K; Datasheet Link: https://industrial.panasonic.com/cdbs/www-data/pdf/ATK0000/ATK0000C376.pdf
J3 = 1932788-1: Package: None; Price: None; Value: *; MP: 1932788-1; Availability: Unavailable

## Nets that join several sheets
3V3: Raspberry PI (8 pins), Optocoupler (7 pins), Power circuit (5 pins), GSM_SOM (6 pins)
4V: Power circuit (C6.1 IC2.4 R6.1 TP8.1), GSM_SOM (5 pins)
5V: Raspberry PI (U5.4), Power circuit (14 pins), GSM_SOM (D8.2 J3.1 U6.24)
GND: Raspberry PI (18 pins), Optocoupler (14 pins), Power circuit (27 pins), GSM_SOM (100 pins)
NetQ6_10: Raspberry PI (U3.17), Optocoupler (Q6.10 R38.1)
NetQ6_12: Raspberry PI (U3.16), Optocoupler (Q6.12 R37.1)
NetQ6_14: Raspberry PI (U3.15), Optocoupler (Q6.14 R28.2)
NetQ6_16: Raspberry PI (U3.14), Optocoupler (Q6.16 R27.2)
NetQ8_12: Raspberry PI (U3.21), Optocoupler (Q8.12 R54.1)
NetQ8_14: Raspberry PI (U3.20), Optocoupler (Q8.14 R44.2)
NetQ8_16: Raspberry PI (U3.19), Optocoupler (Q8.16 R43.2)
NetR36_1: Raspberry PI (U3.31), Optocoupler (R36.1)
NetR39_1: Raspberry PI (U3.29), Optocoupler (R39.1)
NetR40_1: Raspberry PI (U3.27), Optocoupler (R40.1)
NetR41_1: Raspberry PI (U3.26), Optocoupler (R41.1)
NetR42_1: Raspberry PI (U3.25), Optocoupler (R42.1)
NetR45_1: Raspberry PI (U3.24), Optocoupler (R45.1)
RX_1(L): Raspberry PI (U3.12), GSM_SOM (Q5.2 R16.2)
TX_1(L): Raspberry PI (U3.11), GSM_SOM (Q2.2 R14.2)